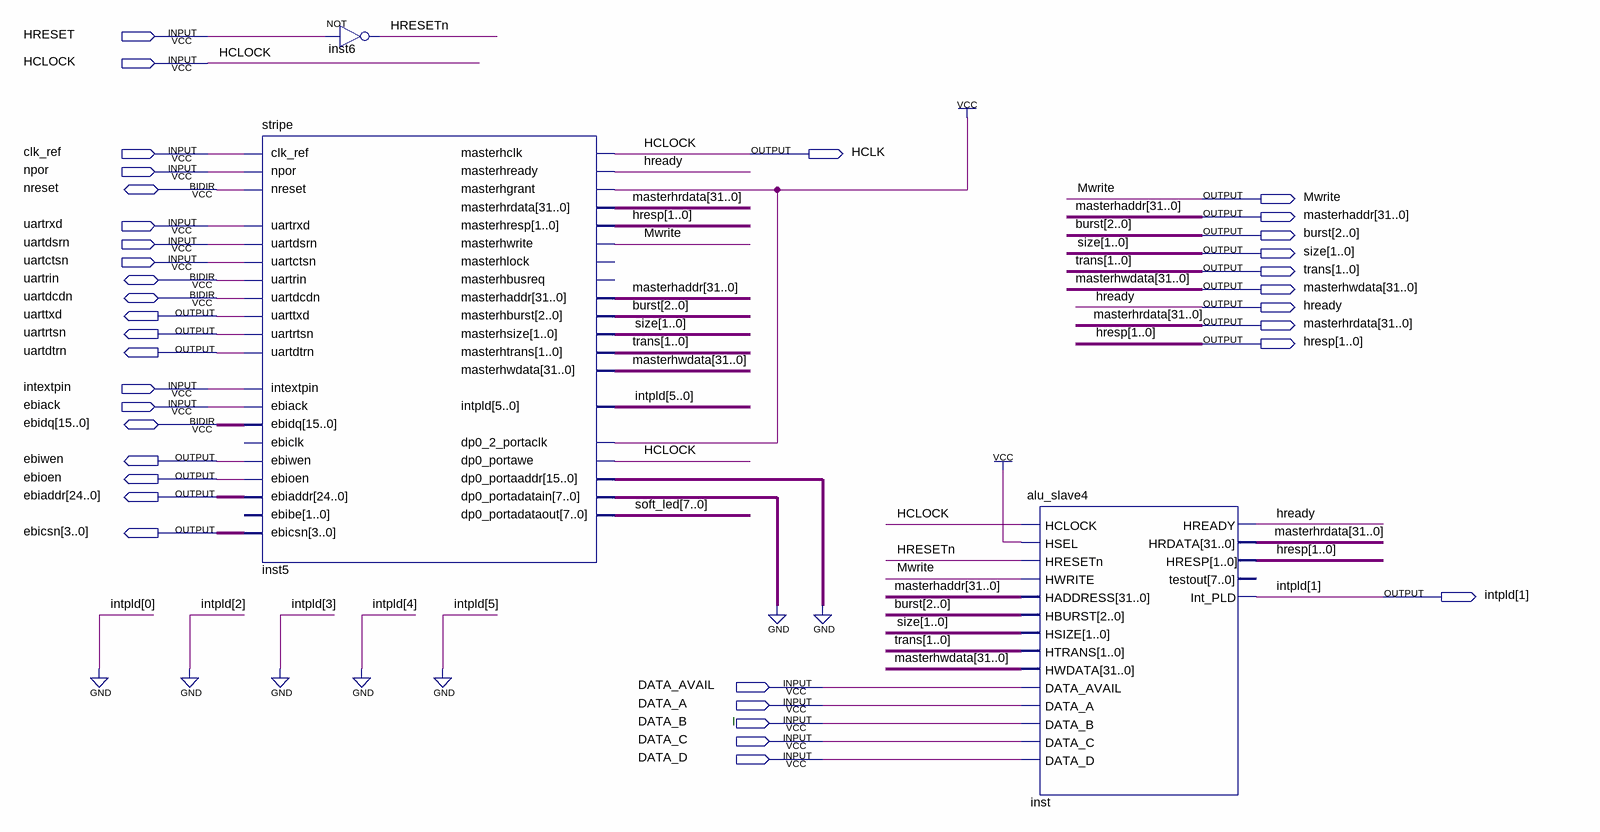
[diagram p0: schematic sheet]
// Quartus schematic arm_top.bdf as structural Verilog: 3 symbols, 36 pins
module arm_top (
  input  HRESET,
  input  HCLOCK,
  input  clk_ref,
  input  npor,
  input  uartrxd,
  input  uartdsrn,
  input  uartctsn,
  input  intextpin,
  input  ebiack,
  input  DATA_AVAIL,
  input  DATA_A,
  input  DATA_B,
  input  DATA_C,
  input  DATA_D,
  inout  nreset,
  inout  uartrin,
  inout  uartdcdn,
  inout  [15:0] ebidq,
  output HCLK,
  output Mwrite,
  output [31:0] masterhaddr,
  output [2:0] burst,
  output [1:0] size,
  output [1:0] trans,
  output [31:0] masterhwdata,
  output hready,
  output uarttxd,
  output [31:0] masterhrdata,
  output uartrtsn,
  output [1:0] hresp,
  output uartdtrn,
  output ebiwen,
  output ebioen,
  output [24:0] ebiaddr,
  output [3:0] ebicsn,
  output [1:1] intpld
);

  wire HRESETn;
  wire [7:0] soft_led;

  stripe inst5 (
    .clk_ref(clk_ref), .npor(npor), .uartrxd(uartrxd), .uartdsrn(uartdsrn), .uartctsn(uartctsn),
    .intextpin(intextpin), .ebiack(ebiack), .masterhclk(HCLOCK), .masterhready(hready), .masterhgrant(1'b1),
    .masterhrdata(masterhrdata), .masterhresp(hresp), .intpld({4'b0000, intpld[1], 1'b0}),
    .dp0_2_portaclk(1'b1), .dp0_portawe(HCLOCK), .dp0_portaaddr({16{1'b0}}), .dp0_portadatain({8{1'b0}}),
    .uarttxd(uarttxd), .uartrtsn(uartrtsn), .uartdtrn(uartdtrn), .ebiwen(ebiwen), .ebioen(ebioen),
    .ebiaddr(ebiaddr), .ebicsn(ebicsn), .masterhwrite(Mwrite), .masterhaddr(masterhaddr),
    .masterhburst(burst), .masterhsize(size), .masterhtrans(trans), .masterhwdata(masterhwdata),
    .dp0_portadataout(soft_led), .nreset(nreset), .uartrin(uartrin), .uartdcdn(uartdcdn), .ebidq(ebidq));  // open: ebiclk, ebibe, masterhlock, masterhbusreq
  not inst6 (HRESETn, HRESET);
  alu_slave4 inst (
    .HCLOCK(HCLOCK), .HSEL(1'b1), .HRESETn(HRESETn), .HWRITE(Mwrite), .HADDRESS(masterhaddr), .HBURST(burst),
    .HSIZE(size), .HTRANS(trans), .HWDATA(masterhwdata), .DATA_AVAIL(DATA_AVAIL), .DATA_A(DATA_A),
    .DATA_B(DATA_B), .DATA_C(DATA_C), .DATA_D(DATA_D), .HREADY(hready), .HRDATA(masterhrdata), .HRESP(hresp),
    .Int_PLD(intpld[1]));  // open: testout

  assign HCLK = HCLOCK;

  // Notes on the sheet:
  //   I
endmodule
